# EAGLE design motor_frontplane (EAGLE 7.6.0)
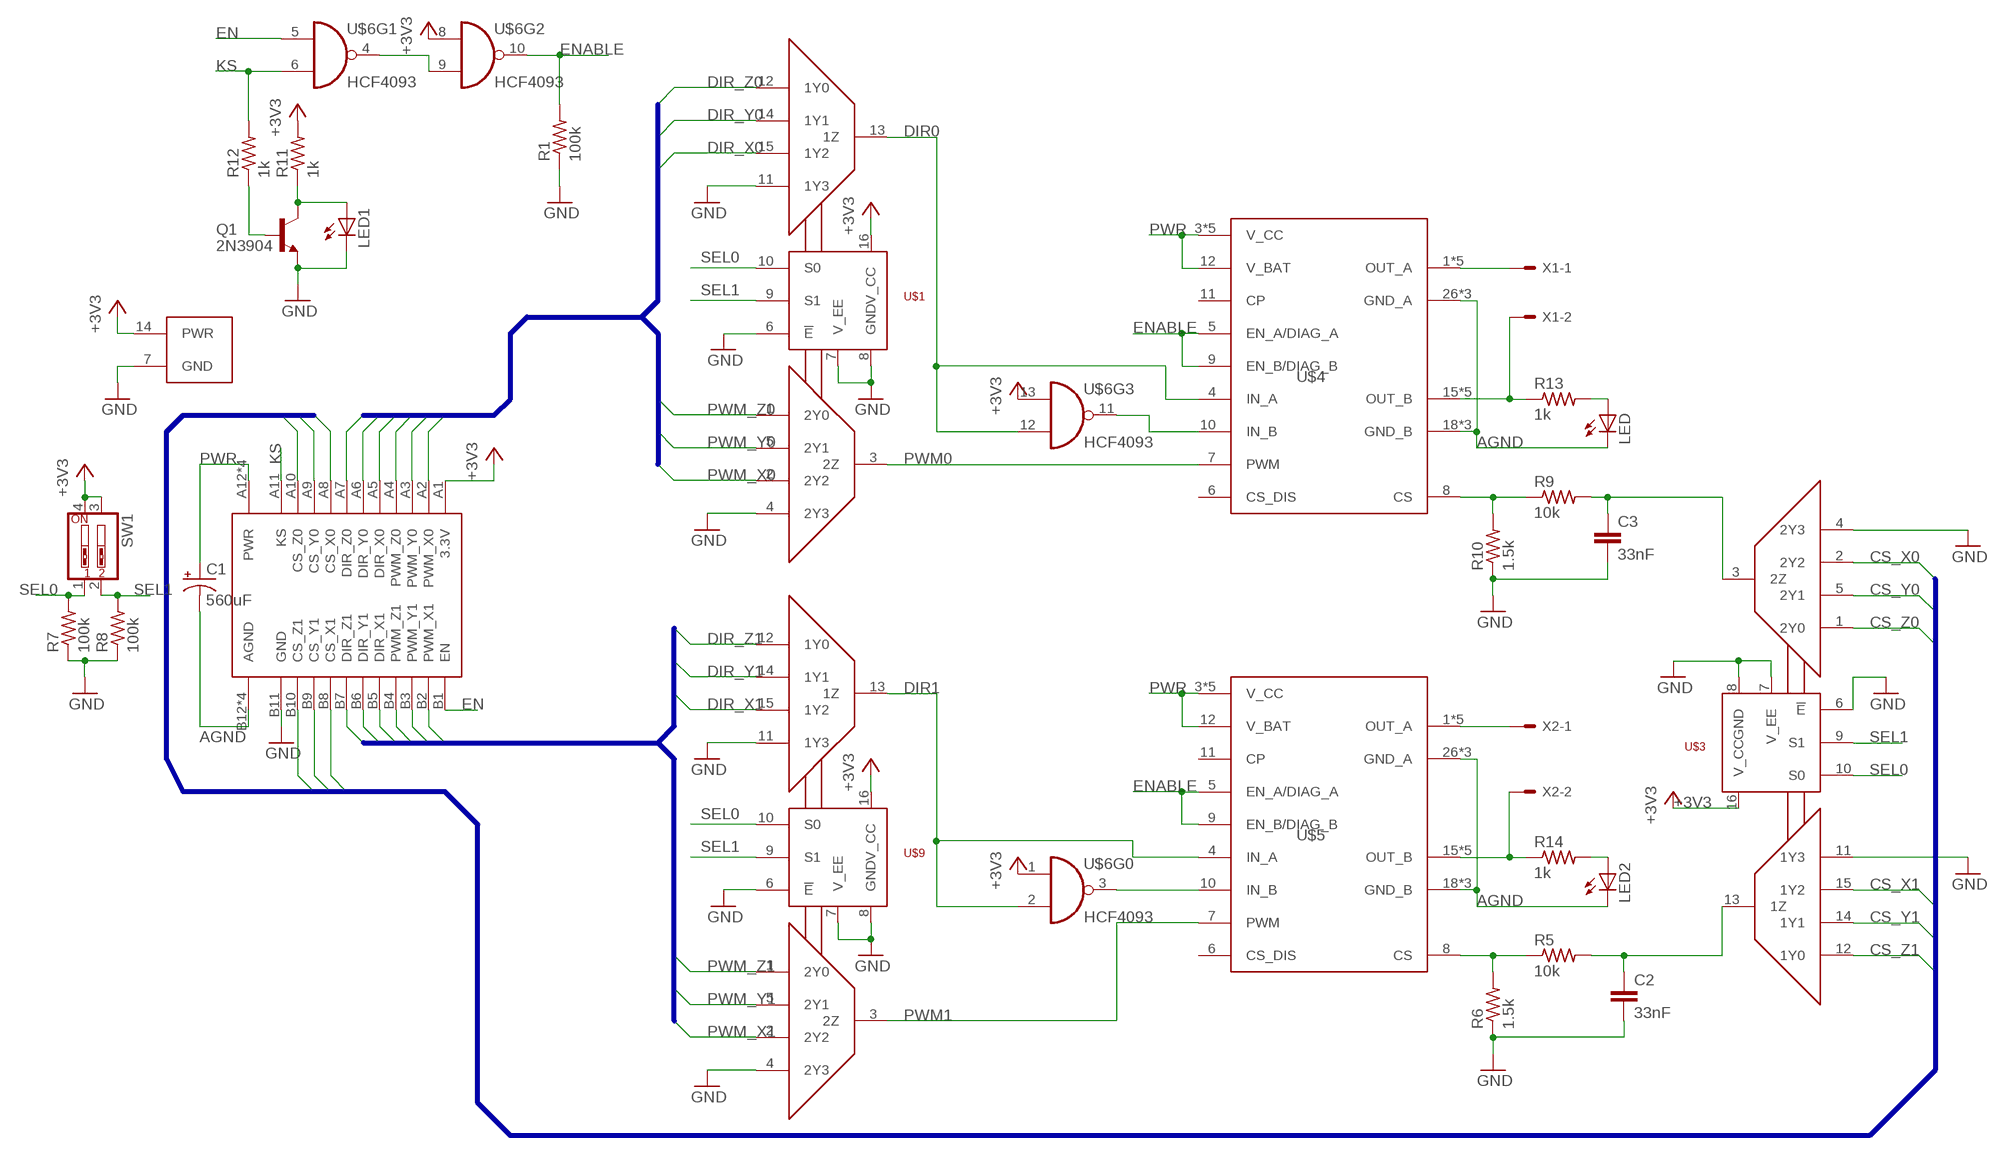
[diagram p0: schematic, sheet 1]

## Parts
C1  560uF  CPOL-USE3.5-10  [E3,5-10]
C2  33nF  C2.5/2  [C2.5-2]
C3  33nF  C2.5/2  [C2.5-2]
LED  LED5MM  [LED5MM]
LED1  LED5MM  [LED5MM]
LED2  LED5MM  [LED5MM]
Q1  2N3904  [TO92]
R1  100k  R-US_R0805  [R0805]
R5  10k  R-US_R0805  [R0805]
R6  1.5k  R-US_R0805  [R0805]
R7  100k  R-US_R0805  [R0805]
R8  100k  R-US_R0805  [R0805]
R9  10k  R-US_R0805  [R0805]
R10  1.5k  R-US_R0805  [R0805]
R11  1k  R-US_R0805  [R0805]
R12  1k  R-US_R0805  [R0805]
R13  1k  R-US_R0805  [R0805]
R14  1k  R-US_R0805  [R0805]
SW1  SW_DIP-2  [EDG-02]
U$1  74HC4052-Q100  [SO16]
U$2  MOTOR_BOARD_CONN  [CARD_30PIN_8PWR]
U$3  74HC4052-Q100  [SO16]
U$4  VNH5019A-E  [MULTIPOWERSO-30]
U$5  VNH5019A-E  [MULTIPOWERSO-30]
U$6  HCF4093  [SO14]
U$9  74HC4052-Q100  [SO16]
X1  KK-156-2  [KK-156-2]
X2  KK-156-2  [KK-156-2]

## Nets
!DIR0: U$4.10(IN_B) U$6.11(O)
!DIR1: U$5.10(IN_B) U$6.3(O)
+3V3: R11.2 SW1.3 SW1.4 U$1.16(V_CC) U$2.A1(3.3V) U$3.16(V_CC) U$6.1(I0) U$6.8(I0) U$6.13(I0) U$6.14(PWR) U$9.16(V_CC)
AGND: C1.- LED2.K(C) LED.K(C) U$2.B12(AGND) U$2.B13(AGND) U$2.B14(AGND) U$2.B15(AGND) U$4.18(GND_B) U$4.19(GND_B) U$4.20(GND_B) U$4.26(GND_A) U$4.27(GND_A) U$4.28(GND_A) U$5.18(GND_B) U$5.19(GND_B) U$5.20(GND_B) U$5.26(GND_A) U$5.27(GND_A) U$5.28(GND_A)
CS0: R9.1 R10.2 U$4.8(CS)
CS1: R5.1 R6.2 U$5.8(CS)
CS_X0: U$2.A8(CS_X0) U$3.2(2Y2)
CS_X1: U$2.B8(CS_X1) U$3.15(1Y2)
CS_Y0: U$2.A9(CS_Y0) U$3.5(2Y1)
CS_Y1: U$2.B9(CS_Y1) U$3.14(1Y1)
CS_Z0: U$2.A10(CS_Z0) U$3.1(2Y0)
CS_Z1: U$2.B10(CS_Z1) U$3.12(1Y0)
DIR0: U$1.13(1Z) U$4.4(IN_A) U$6.12(I1)
DIR1: U$5.4(IN_A) U$6.2(I1) U$9.13(1Z)
DIR_X0: U$1.15(1Y2) U$2.A5(DIR_X0)
DIR_X1: U$2.B5(DIR_X1) U$9.15(1Y2)
DIR_Y0: U$1.14(1Y1) U$2.A6(DIR_Y0)
DIR_Y1: U$2.B6(DIR_Y1) U$9.14(1Y1)
DIR_Z0: U$1.12(1Y0) U$2.A7(DIR_Z0)
DIR_Z1: U$2.B7(DIR_Z1) U$9.12(1Y0)
EN: U$2.B1(EN) U$6.5(I0)
ENABLE: R1.2 U$4.5(EN_A/DIAG_A) U$4.9(EN_B/DIAG_B) U$5.5(EN_A/DIAG_A) U$5.9(EN_B/DIAG_B) U$6.10(O)
GND: C2.2 C3.2 LED1.K(C) Q1.3(E) R1.1 R6.1 R7.1 R8.1 R10.1 U$1.4(2Y3) U$1.6(!E) U$1.7(V_EE) U$1.8(GND) U$1.11(1Y3) U$2.B11(GND) U$3.4(2Y3) U$3.6(!E) U$3.7(V_EE) U$3.8(GND) U$3.11(1Y3) U$6.7(GND) U$9.4(2Y3) U$9.6(!E) U$9.7(V_EE) U$9.8(GND) U$9.11(1Y3)
KS: R12.2 U$2.A11(KS) U$6.6(I1)
N$5: U$6.4(O) U$6.9(I1)
N$7: C2.1 R5.2 U$3.13(1Z)
N$16: LED2.A R14.2
N$23: C3.1 R9.2 U$3.3(2Z)
N$25: LED1.A Q1.1(C) R11.1
N$26: Q1.2(B) R12.1
N$28: LED.A R13.2
OUT_A0: U$4.1(OUT_A) U$4.25(OUT_A) U$4.30(OUT_A) U$4.OUTA(OUT_A) U$4.OUTA@1(OUT_A) X1.1
OUT_A1: U$5.1(OUT_A) U$5.25(OUT_A) U$5.30(OUT_A) U$5.OUTA(OUT_A) U$5.OUTA@1(OUT_A) X2.1
OUT_B0: R13.1 U$4.15(OUT_B) U$4.16(OUT_B) U$4.21(OUT_B) U$4.OUTB(OUT_B) U$4.OUTB@1(OUT_B) X1.2
OUT_B1: R14.1 U$5.15(OUT_B) U$5.16(OUT_B) U$5.21(OUT_B) U$5.OUTB(OUT_B) U$5.OUTB@1(OUT_B) X2.2
PWM0: U$1.3(2Z) U$4.7(PWM)
PWM1: U$5.7(PWM) U$9.3(2Z)
PWM_X0: U$1.2(2Y2) U$2.A2(PWM_X0)
PWM_X1: U$2.B2(PWM_X1) U$9.2(2Y2)
PWM_Y0: U$1.5(2Y1) U$2.A3(PWM_Y0)
PWM_Y1: U$2.B3(PWM_Y1) U$9.5(2Y1)
PWM_Z0: U$1.1(2Y0) U$2.A4(PWM_Z0)
PWM_Z1: U$2.B4(PWM_Z1) U$9.1(2Y0)
PWR: C1.+ U$2.A12(PWR) U$2.A13(PWR) U$2.A14(PWR) U$2.A15(PWR) U$4.3(V_CC) U$4.12(V_BAT) U$4.13(V_CC) U$4.23(V_CC) U$4.VCC(V_CC) U$4.VCC@1(V_CC) U$5.3(V_CC) U$5.12(V_BAT) U$5.13(V_CC) U$5.23(V_CC) U$5.VCC(V_CC) U$5.VCC@1(V_CC)
SEL0: R7.2 SW1.1 U$1.10(S0) U$3.10(S0) U$9.10(S0)
SEL1: R8.2 SW1.2 U$1.9(S1) U$3.9(S1) U$9.9(S1)
Unconnected: U$4.6(CS_DIS) U$4.11(CP) U$5.6(CS_DIS) U$5.11(CP)

## Buses
DIR_X1,DIR_Y1,DIR_Z1,PWM_X1,PWM_Y1,PWM_Z1
DIR_X0,DIR_Y0,DIR_Z0,PWM_X0,PWM_Y0,PWM_Z0
CS_X0,CS_X1,CS_Y0,CS_Y1,CS_Z0,CS_Z1

## Library data of the parts
C1 = rcl:CPOL-US: POLARIZED CAPACITOR, American symbol
C2 C3 = capacitor-wima:C: CAPACITOR naming: grid - package width
LED LED1 LED2 = led:LED: LED OSRAM: - CHIPLED LG R971, LG N971, LY N971, LG Q971, LY Q971, LO R971, LY R971 LH N974, LH R974 LS Q976, LO Q976, LY Q976 LO Q996 - Hyper CHIPLED LW Q18S LB Q993, LB Q99A, LB R99A - SideLED LS A670, LO A670, LY A670, LG A670, LP A670 LB A673, LV A673, LT A673, LW A673 LH A674 LY A675 LS A676, LA A676, LO A676, LY A676, LW A676 LS A679, LY A679, LG A679 - Hyper Micro SIDELED® LS Y876, LA Y876, LO Y876, LY Y876 LT Y87S - SmartLED LW L88C, LW L88S LB L89C, LB L89S, LG L890 LS L89K, LO L89K, LY L89K LS L896, LA L896, LO L896, LY L896 - TOPLED LS T670, LO T670, LY T670, LG T670, LP T670 LSG T670, LSP T670, LSY T670, LOP T670, LYG T670 LG T671, LOG T671, LSG T671 LB T673, LV T673, LT T673, LW T673 LH T674 LS T676, LA T676, LO T676, LY T676, LB T676, LH T676, LSB T676, LW T676 LB T67C, LV T67C, LT T67C, LS T67K, LO T67K, LY T67K, LW E67C LS E67B, LA E67B, LO E67B, LY E67B, LB E67C, LV E67C, LT E67C LW T67C LS T679, LY T679, LG T679 LS T770, LO T770, LY T770, LG T770, LP T770 LB T773, LV T773, LT T773, LW T773 LH T774 LS E675, LA E675, LY E675, LS T675 LS T776, LA T776, LO T776, LY T776, LB T776 LHGB T686 LT T68C, LB T68C - Hyper Mini TOPLED® LB M676 - Mini TOPLED Santana® LG M470 LS M47K, LO M47K, LY M47K Source: http://www.osram.convergy.de LUXEON: - LUMILED® LXK2-PW12-R00, LXK2-PW12-S00, LXK2-PW14-U00, LXK2-PW14-V00 LXK2-PM12-R00, LXK2-PM12-S00, LXK2-PM14-U00 LXK2-PE12-Q00, LXK2-PE12-R00, LXK2-PE12-S00, LXK2-PE14-T00, LXK2-PE14-U00 LXK2-PB12-K00, LXK2-PB12-L00, LXK2-PB12-M00, LXK2-PB14-N00, LXK2-PB14-P00, LXK2-PB14-Q00 LXK2-PR12-L00, LXK2-PR12-M00, LXK2-PR14-Q00, LXK2-PR14-R00 LXK2-PD12-Q00, LXK2-PD12-R00, LXK2-PD12-S00 LXK2-PH12-R00, LXK2-PH12-S00 LXK2-PL12-P00, LXK2-PL12-Q00, LXK2-PL12-R00 Source: www.luxeon.com KINGBRIGHT: KA-3528ASYC Source: www.kingbright.com
Q1 = transistor:2N3904: NPN TRANSISTOR
R1 R5-R14 = rcl:R-US_: RESISTOR, American symbol
SW1 = special:SW_DIP-2: DIP SWITCH
U$1 U$3 U$9 = ARVP:74HC4052-Q100: Dual 4X1 MUX / DEMUX
U$2 = ARVP:MOTOR_BOARD_CONN
U$4 U$5 = ARVP:VNH5019A-E
U$6 = ARVP:HCF4093: Quad 2 Input NAND IC
X1 X2 = con-molex:KK-156-2: KK 156 HEADER Source: http://www.molex.com/pdm_docs/sd/026604100_sd.pdf; OC_FARNELL: unknown; OC_NEWARK: unknown

## Board
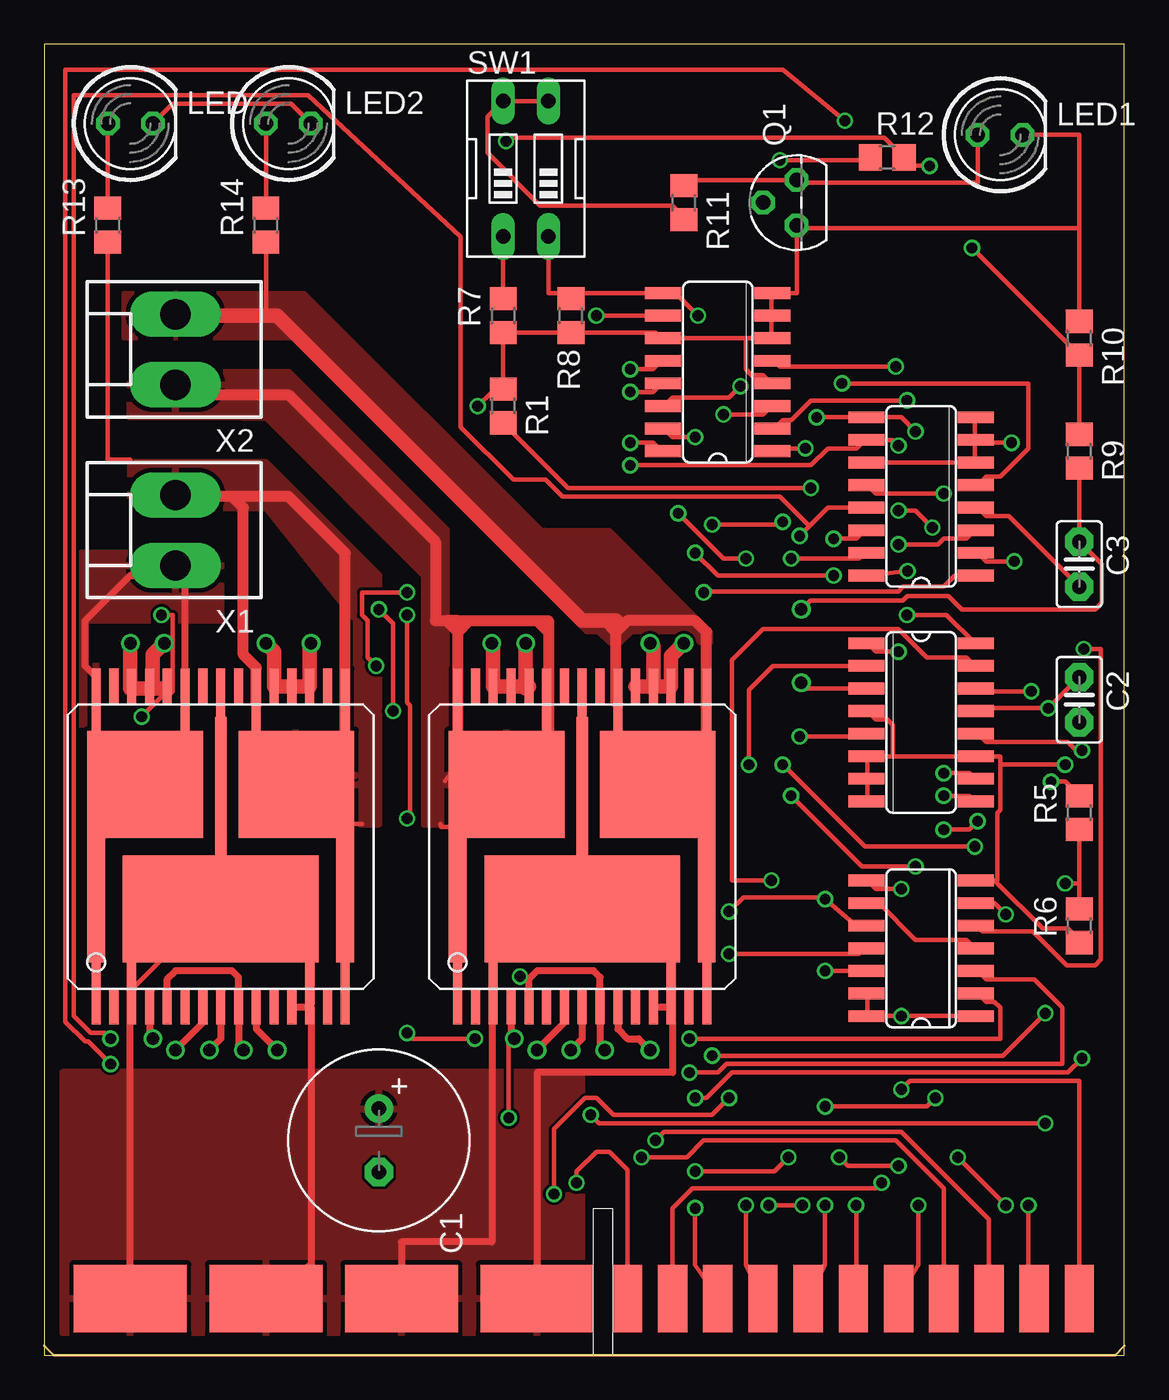
[diagram p1: board, top side]
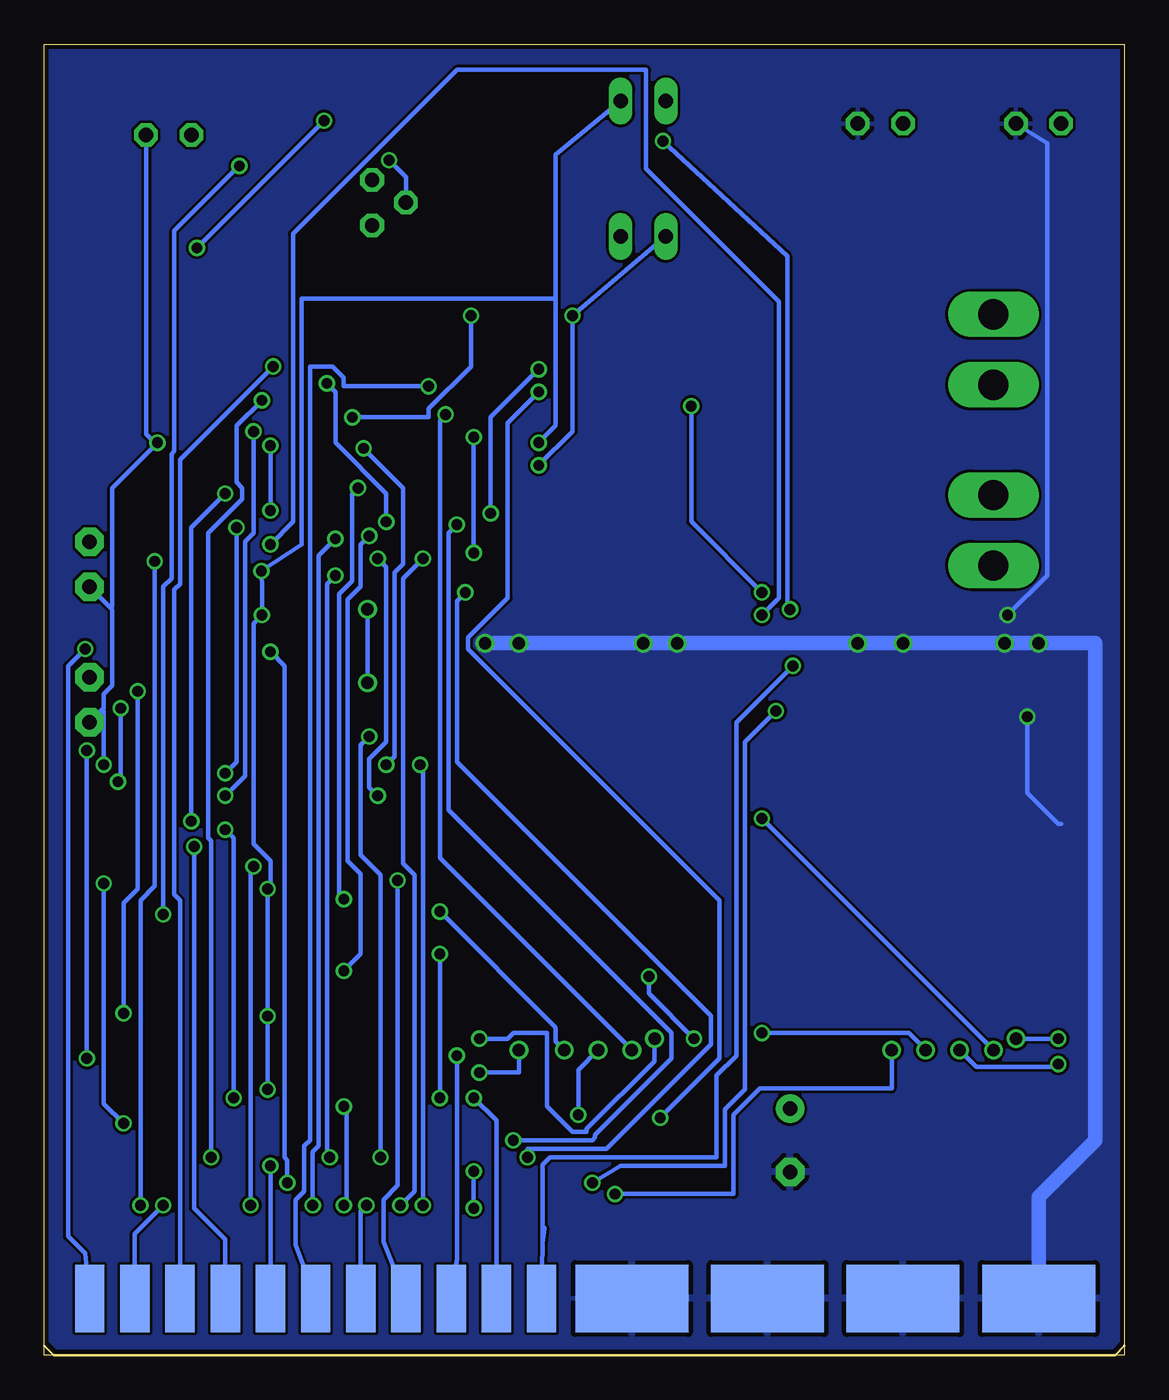
[diagram p2: board, bottom side, seen from below]

Size 60.71 x 73.66 mm. Coordinates in mm from the lower left corner, seen from the top.
Outline: 0,0 60.71,0 60.71,73.66 0,73.66 0,0
Copper layers (1*16): Top 0.035mm / dielectric 1.5mm / Bottom 0.035mm
Design rules "ITEADstudioDRC": minimum track width 6mil, minimum drill 12mil, track to track 6mil, track to pad 6mil, pad to pad 6mil, via to via 6mil, smd to smd 0mil, copper to edge 10mil, drill to drill 10mil, minimum pad ring 10mil, minimum via ring 6mil, stop-mask expansion 2mil, vias tented up to drill 100mil, thermal gap 10mil

### Footprints (pad centres in the part's own frame; a part is rotated, then mirrored left to right if it is on the bottom)
E3,5-10 = drill 0.813 pad 1.6: + -1.778,0 | drill 0.813 pad 1.6 octagon: - 1.778,0
C2.5-2 = drill 0.813 pad 1.6 octagon: 1 -1.27,0; 2 1.27,0
LED5MM = drill 0.813 octagon: A -1.27,0; K 1.27,0
TO92 = drill 0.813 octagon: 1 1.27,0; 2 0,1.905; 3 -1.27,0
R0805 = smd 1.3 x 1.5: 1 -0.95,0; 2 0.95,0
EDG-02 = drill 0.813 long: 1 -1.27,-3.81; 2 1.27,-3.81; 3 1.27,3.81; 4 -1.27,3.81
SO16 = smd 0.66 x 2.032: 1 -4.445,-3.073; 2 -3.175,-3.073; 3 -1.905,-3.073; 4 -0.635,-3.073; 5 0.635,-3.073; 6 1.905,-3.073; 7 3.175,-3.073; 8 4.445,-3.073; 9 4.445,3.073; 10 3.175,3.073; 11 1.905,3.073; 12 0.635,3.073; 13 -0.635,3.073; 14 -1.905,3.073; 15 -3.175,3.073; 16 -4.445,3.073
CARD_30PIN_8PWR = smd 1.651 x 3.81: A1 10.16,0.635; A2 7.62,0.635; A3 5.08,0.635; A4 2.54,0.635; A5 0,0.635; A6 -2.54,0.635; A7 -5.08,0.635; A8 -7.62,0.635; A9 -10.16,0.635; A10 -12.7,0.635; A11 -15.24,0.635 | smd 6.35 x 3.81: A12 -20.32,0.635; A13 -27.94,0.635; A14 -35.56,0.635; A15 -43.18,0.635 | smd 1.651 x 3.81 bottom: B1 10.16,0.635; B2 7.62,0.635; B3 5.08,0.635; B4 2.54,0.635; B5 0,0.635; B6 -2.54,0.635; B7 -5.08,0.635; B8 -7.62,0.635; B9 -10.16,0.635; B10 -12.7,0.635; B11 -15.24,0.635 | smd 6.35 x 3.81 bottom: B12 -20.32,0.635; B13 -27.94,0.635; B14 -35.56,0.635; B15 -43.18,0.635
MULTIPOWERSO-30 = smd 0.508 x 12: 1 -7,-4; 15 7,-4; 16 7,4; 30 -7,4 | smd 0.508 x 2: 2 -6,-9; 4 -4,-9; 5 -3,-9; 6 -2,-9; 7 -1,-9; 8 0,-9; 9 1,-9; 10 2,-9; 11 3,-9; 12 4,-9; 14 6,-9; 17 6,9; 18 5,9; 19 4,9; 20 3,9; 22 1,9; 24 -1,9; 26 -3,9; 27 -4,9; 28 -5,9; 29 -6,9 | smd 0.508 x 4: 3 -5,-8; 13 5,-8; 21 2,8; 23 0,8; 25 -2,8 | smd 6.5 x 6: OUTA -4.25,3.5; OUTB 4.25,3.5 | smd 1 x 7.5: OUTA@1 -7,-2.755; OUTB@1 7,-2.755 | smd 11 x 6: VCC 0,-3.5 | smd 0.65 x 8.3: VCC@1 0,3.145
SO14 = smd 0.66 x 2.032: 1 -3.81,-3.073; 2 -2.54,-3.073; 3 -1.27,-3.073; 4 0,-3.073; 5 1.27,-3.073; 6 2.54,-3.073; 7 3.81,-3.073; 8 3.81,3.073; 9 2.54,3.073; 10 1.27,3.073; 11 0,3.073; 12 -1.27,3.073; 13 -2.54,3.073; 14 -3.81,3.073
KK-156-2 = drill 1.7 pad 2.184 long: 1 -1.98,0; 2 1.98,0

### Placement (x,y rotation side)
C1  18.8,12.06 270 top
C2  58.17,36.83 270 top
C3  58.17,44.45 270 top
LED  4.83,69.22 0 top
LED1  53.72,68.58 0 top
LED2  13.72,69.22 0 top
Q1  42.29,64.77 90 top
R1  25.78,53.34 270 top
R5  58.17,30.48 90 top
R6  58.17,24.13 90 top
R7  25.78,58.42 90 top
R8  29.59,58.42 90 top
R9  58.17,50.8 270 top
R10  58.17,57.15 270 top
R11  35.94,64.77 270 top
R12  47.37,67.31 0 top
R13  3.56,63.5 90 top
R14  12.45,63.5 90 top
SW1  27.05,66.67 0 top
U$1  49.28,48.26 90 top
U$2  48.01,2.54 0 top
U$3  49.28,35.56 270 top
U$4  9.91,28.57 0 top
U$5  30.23,28.57 0 top
U$6  49.28,22.86 90 top
U$9  37.85,55.24 90 top
X1  7.37,46.35 90 top
X2  7.37,56.52 90 top

### Tracks (layer width: path | path; a pad name or v marks a point on that pad's centre or on a via)
!DIR0  (via drill 0.61, 0.7)
  Top 0.254: v38.48,22.54 45.78,22.54 46.1,22.86 U$6.11 | v38.48,14.45 37.53,13.49 31.97,13.49 31.02,14.45 30.39,14.45 28.64,12.7 v28.64,9.05
  Top 0.406: U$4.10 11.91,18.32 v13.08,17.14
  Bottom 0.254: v38.48,14.45 v38.48,22.54 | v28.64,9.05 21.97,9.05 21.97,13.49 20.48,14.99 13.08,14.99 v13.08,17.14
!DIR1  (via drill 0.61, 0.7)
  Top 0.254: v36.26,15.88 37.85,15.88 38.32,16.35 57.21,16.35 57.21,19.53 55.63,21.11 52.93,21.11 52.45,21.59 U$6.3
  Top 0.406: U$5.10 32.23,18.32 32.77,17.78 33.4,17.78 v34.04,17.14
  Bottom 0.254: v36.26,15.88 34.04,15.88 v34.04,17.14
+3V3  (via drill 0.61)
  Top 0.254: R11.2 35.94,63.98 35.31,64.61 27.84,64.61 24.89,67.56 24.89,69.6 SW1.4 SW1.3 | v32.92,51.28 34.2,51.28 34.67,50.8 U$9.16 | 46.26,19.05 46.26,20.32 U$6.13 | 46.26,19.05 v48.16,19.05 U$6.1 | 46.26,19.05 U$6.14 | v48.16,26.19 46.74,26.19 46.26,26.67 U$6.8 | v48.48,41.59 50.7,41.59 52.29,40.01 U$3.16 | v48.51,44.07 U$1.16 | U$2.A1 58.17,15.4 48.64,15.4 v48.16,14.92
  Bottom 0.254: v32.92,51.28 31.97,52.23 31.97,59.37 | 31.97,59.37 31.97,67.47 SW1.3 | v48.16,14.92 v48.16,19.05 v48.16,26.19 48.01,26.35 48.01,27.78 48.96,28.73 48.96,41.12 v48.48,41.59 48.48,43.34 v48.51,44.07 46.26,45.56 46.26,59.37 31.97,59.37
AGND  (via drill 0.61, 0.7)
  Top 0.254: U$4.28 U$4.27 U$4.26 | U$4.19 13.88,37.62 13.88,37.58 | v5.46,35.88 6.57,36.99 6.89,36.99 7.21,37.31 7.21,41.59 v6.57,41.59 | U$5.27 26.26,37.62 26.26,37.58 | LED2.K 13.88,70.33 7.21,70.33 LED.K
  Top 0.406: U$4.26 6.21,37.58 6.1,37.47 | U$4.27 4.94,37.58 4.83,37.47
  Top 0.813: v4.83,40.01 4.83,37.47 6.73,37.47 | 6.1,37.47 6.1,39.37 v6.73,40.01 | v12.45,40.01 12.91,39.55 U$4.20 13.88,37.58 U$4.19 U$4.18 14.91,39.92 v14.99,40.01 | v25.15,40.01 25.23,39.92 U$5.28 U$5.27 26.26,37.58 U$5.26 27.16,37.58 27.05,37.47 v27.05,40.01 | U$5.19 34.23,39.81 v34.04,40.01 | v35.94,40.01 35.23,39.29 U$5.18 U$5.20
  Bottom 0.254: v5.46,35.88 5.46,31.59 3.71,29.84 3.56,29.84 | v6.57,41.59 4.35,43.81 4.35,68.1 LED.K
  Bottom 0.813: v35.94,40.01 v25.15,40.01 v6.73,40.01 | v6.73,40.01 v4.83,40.01 | v6.73,40.01 1.65,40.01 1.65,12.06 4.83,8.89 U$2.B15
  pour Bottom: 1.02,1.27 30.23,1.27 30.23,13.34 2.92,13.34 3.56,29.84 1.02,34.92
  pour Bottom: 3.56,28.57 3.56,36.83 37.21,36.83 37.21,41.27 1.02,41.27 1.02,28.57
  pour Bottom: 72.9,-8.38 72.9,75.69 72.64,75.95 -6.6,75.95 -6.6,-7.62 -6.6,-8.13 -6.35,-8.38
CS0  (via drill 0.61, 0.7)
  Top 0.254: R9.1 R10.2 58.17,56.36 58.01,56.36 v52.13,62.23 | v3.71,16.35 2.44,17.62 2.29,17.62 1.18,18.73 1.18,72.23 41.5,72.23 v44.99,69.37
  Top 0.406: U$4.8 9.91,17.78 v9.27,17.14
  Bottom 0.254: v9.27,17.14 8.32,16.19 3.71,16.19 v3.71,16.35 | v52.13,62.23 v44.99,69.37
CS1  (via drill 0.61, 0.7)
  Top 0.254: R5.1 58.17,26.51 | 58.17,26.51 R6.2 | v30.7,13.49 31.18,13.02 v56.26,13.02 | 58.17,26.51 v57.37,26.51
  Top 0.406: U$5.8 30.23,17.78 v29.59,17.14
  Bottom 0.254: v29.59,17.14 30.7,16.03 v30.7,13.49 | v56.26,13.02 57.37,14.13 v57.37,26.51
CS_X0  (via drill 0.61)
  Top 0.254: v39.43,8.41 39.43,5.08 U$2.A8 | v39.59,33.18 39.59,37.37 40.96,38.73 U$3.2 46.99,38.73
  Bottom 0.254: v39.59,33.18 39.43,33.02 v39.43,8.41
CS_X1  (via drill 0.61)
  Top 0.254: v40.86,26.67 38.64,26.67 38.64,39.05 40.39,40.8 48.01,40.8 49.59,39.21 51.82,39.21 52.29,38.73 U$3.15
  Bottom 0.254: v40.86,26.67 40.86,9.53 41.66,8.73 41.66,6.35 U$2.B8
CS_Y0  (via drill 0.61)
  Top 0.254: v42.45,34.77 45.94,34.77 46.1,34.92 U$3.5 | v41.81,11.11 41.02,10.32 v36.58,10.32 | v36.58,8.26 36.58,5.08 U$2.A9
  Bottom 0.254: v42.45,34.77 42.93,34.29 42.93,28.1 41.81,26.99 v41.81,11.11 | v36.58,8.26 v36.58,10.32
CS_Y1  (via drill 0.61)
  Top 0.254: v55.47,37.31 52.61,37.31 52.45,37.47 U$3.14 | v56.26,19.21 53.88,16.83 v37.53,16.83
  Bottom 0.254: v55.47,37.31 55.47,26.19 56.26,25.4 v56.26,19.21 | v37.53,16.83 37.53,5.4 U$2.B9
CS_Z0  (via drill 0.61)
  Top 0.254: v48.01,39.53 46.74,39.53 46.26,40.01 U$3.1 | v47.05,9.68 46.74,9.37 36.42,9.37 35.31,8.26 U$2.A10
  Bottom 0.254: v48.01,39.53 47.21,38.73 47.21,11.11 47.05,10.95 v47.05,9.68
CS_Z1  (via drill 0.61)
  Top 0.254: v58.33,33.97 58.01,33.97 57.53,34.45 52.93,34.45 52.45,34.92 U$3.12 | v58.33,16.67 57.53,15.88 38.64,15.88 37.21,14.45 v36.58,14.45
  Bottom 0.254: v58.33,16.67 v58.33,33.97 | v36.58,14.45 35.31,13.18 U$2.B10
DIR0  (via drill 0.61, 0.7)
  Top 0.254: v43.88,21.59 U$6.12 | 43.01,46.59 44.04,47.62 U$1.13 | 43.01,46.59 v42.45,46.04 | v3.71,17.78 3.4,18.1 2.6,18.1 1.65,19.05 1.65,70.8 14.83,70.8 23.4,62.87 23.4,52.16 26.35,49.21 28.16,49.21 29.11,48.26 41.34,48.26 43.01,46.59
  Top 0.406: U$4.4 5.91,17.97 v6.1,17.78
  Bottom 0.254: v43.88,21.59 42.93,22.54 42.93,27.05 43.66,27.78 43.66,42.45 42.93,43.18 42.93,45.56 v42.45,46.04 | v3.71,17.78 v6.1,17.78
DIR1  (via drill 0.61, 0.7)
  Top 0.254: v36.26,17.78 53.72,17.78 53.72,19.53 53.4,19.84 52.93,19.84 52.45,20.32 U$6.2 | v32.92,54.13 34.2,54.13 34.67,54.61 U$9.13 | v26.1,13.34 26.1,17.94 v26.42,17.78
  Top 0.406: U$5.4 26.23,17.97 v26.42,17.78
  Bottom 0.254: v36.26,17.78 34.67,17.78 34.35,18.1 32.45,18.1 32.45,13.97 31.02,12.54 30.23,12.54 30.23,12.7 26.42,16.51 v26.42,17.78 | v32.92,54.13 34.67,52.39 34.67,42.55 36.89,40.32 36.89,39.69 22.77,25.56 22.77,16.67 v26.1,13.34
DIR_X0  (via drill 0.61)
  Top 0.254: v41.97,44.77 45.78,44.77 46.1,45.09 U$1.15 | v41.97,31.43 45.94,27.46 v48.96,27.46 | v49.12,8.41 49.12,5.08 U$2.A5
  Bottom 0.254: v41.97,44.77 41.5,44.29 41.5,34.45 42.45,33.5 42.45,31.91 v41.97,31.43 | v48.96,27.46 49.12,27.3 v49.12,8.41
DIR_X1  (via drill 0.61)
  Top 0.254: v36.58,51.59 35.31,51.59 34.83,52.07 U$9.15 | v36.58,45.09 37.85,43.81 v44.35,43.81 | v44.67,11.11 45.15,10.64 v48.01,10.64
  Bottom 0.254: v36.58,45.09 v36.58,51.59 | v44.35,43.81 44.83,43.34 44.83,11.27 v44.67,11.11 | U$2.B5 v48.01,10.64
DIR_Y0  (via drill 0.61)
  Top 0.254: v44.35,45.88 45.62,45.88 46.1,46.35 U$1.14 | v45.62,8.41 45.62,5.08 U$2.A6
  Bottom 0.254: v44.35,45.88 45.31,44.93 45.31,11.75 45.62,11.43 v45.62,8.41
DIR_Y1  (via drill 0.61)
  Top 0.254: v39.12,54.45 38.48,53.82 35.31,53.82 34.83,53.34 U$9.14
  Bottom 0.254: v39.12,54.45 43.88,54.45 43.88,54.93 44.51,55.56 45.78,55.56 45.78,12.06 46.1,11.75 46.1,9.21 46.58,8.73 46.58,6.19 U$2.B6
DIR_Z0  (via drill 0.61)
  Top 0.254: v50.55,48.42 46.74,48.42 46.26,48.9 U$1.12 | v52.45,30 51.98,29.53 v50.55,29.53 | v50.07,14.45 49.59,13.97 v43.88,13.97 | v43.88,8.41 43.88,5.08 U$2.A7
  Bottom 0.254: v50.55,48.42 52.45,46.51 v52.45,30 | v50.55,29.53 50.07,29.05 v50.07,14.45 | v43.88,13.97 43.72,13.81 43.72,8.57 v43.88,8.41
DIR_Z1  (via drill 0.61)
  Top 0.254: v32.92,55.4 34.2,55.4 34.67,55.88 U$9.12 | v35.62,47.31 38.16,44.77 v39.43,44.77 | v42.61,8.41 v40.7,8.41
  Bottom 0.254: v32.92,55.4 35.62,52.7 v35.62,47.31 | v39.43,44.77 40.55,43.66 40.55,27.62 39.91,26.99 39.91,9.21 v40.7,8.41 | v42.61,8.41 42.93,8.1 U$2.B7
EN  (via drill 0.61)
  Top 0.254: v58.42,39.69 59.37,39.69 59.37,22.23 59.05,21.91 57.47,21.91 55.56,23.81 52.7,23.81 52.39,24.13 U$6.5
  Bottom 0.254: v58.42,39.69 59.37,38.73 59.37,6.67 58.42,5.71 U$2.B1
ENABLE  (via drill 0.61, 0.7)
  Top 0.254: v20.38,18.1 20.7,17.78 v24.19,17.78 | v26.73,21.27 26.89,21.11 27.05,21.11 27.23,21.13 | v43.09,48.74 29.43,48.74 R1.2 | U$6.10 45.62,24.13 v43.88,25.62 43.88,25.72 39.27,25.72 v38.48,24.92
  Top 0.406: U$4.5 6.91,21.13 7.37,21.59 10.54,21.59 10.91,21.23 U$4.9 10.91,17.41 v11.18,17.14 | v31.5,17.14 31.23,17.41 U$5.9 31.23,21.23 30.86,21.59 27.69,21.59 27.23,21.13 U$5.5
  Bottom 0.254: v11.18,17.14 12.13,18.1 v20.38,18.1 | v24.19,17.78 26.73,20.32 v26.73,21.27 | v43.09,48.74 43.4,48.42 43.4,43.5 44.13,42.77 44.13,25.88 v43.88,25.62 | v31.5,17.14 31.97,17.62 31.97,18.41 v38.48,24.92
GND  (via drill 0.61)
  Top 0.254: 53.48,26.59 53.4,26.67 U$6.7 | 53.48,26.59 56.1,23.97 57.53,23.97 58.17,23.34 R6.1 | 46.26,32.38 46.26,31.11 U$3.8 | 46.26,32.38 46.26,33.66 | 46.26,32.38 U$3.7 | 47.69,33.66 47.69,35.4 47.37,35.72 46.74,35.72 46.26,36.2 U$3.4 | 46.26,33.66 47.69,33.66 | 46.26,33.66 U$3.6 | 47.69,33.66 U$3.11 53.72,33.66 53.72,33.18 | 53.72,33.18 53.72,30.64 53.56,30.48 53.56,26.67 53.48,26.59 | 52.29,51.44 52.29,52.7 U$1.8 | 52.29,50.16 U$1.11 | 52.29,50.16 52.29,51.44 | 52.29,51.44 U$1.7 52.45,51.44 52.61,51.28 v54.36,51.28 | 52.29,50.16 U$1.6 | C3.2 54.2,47.15 52.93,47.15 52.45,47.62 U$1.4 | v57.37,33.18 53.72,33.18 | 58.17,63.34 58.17,68.58 LED1.K | 58.17,63.34 R10.1 | 40.86,58.42 40.86,59.69 U$9.8 42.29,59.69 42.29,63.34 | 39.43,57.15 39.43,55.4 39.75,55.09 40.39,55.09 40.86,54.61 U$9.4 | 40.86,57.15 39.43,57.15 | 40.86,57.15 40.86,58.42 | 40.86,58.42 U$9.7 | 40.86,57.15 U$9.6 | R7.1 R1.1 25.78,54.13 25.15,54.13 v24.35,53.34 | R7.1 R8.1 | R7.1 | R8.1 34.35,57.47 34.67,57.15 U$9.11 39.43,57.15 | R8.1 | v18.64,38.73 18.16,39.21 18.16,41.27 17.84,41.59 17.84,42.86 v20.38,42.86 | 42.29,63.34 58.17,63.34 | 42.29,63.34 Q1.3
  Bottom 0.254: 57.45,36.27 57.37,36.35 57.37,37.15 56.9,37.62 56.9,41.91 56.98,41.99 | 57.45,36.27 C2.2 | C3.2 56.98,41.99 | 56.98,41.99 56.9,42.07 56.9,48.74 v54.36,51.28 54.52,51.28 54.99,51.75 LED1.K | v57.37,33.18 57.37,36.2 57.45,36.27 | 32.61,7.14 32.7,6.31 | 32.7,6.31 U$2.B11 | v18.64,38.73 21.81,35.56 21.81,16.83 22.92,15.72 22.92,11.11 32.29,11.11 32.7,10.7 32.7,6.31 | v20.38,42.86 24.35,46.83 v24.35,53.34
KS  (via drill 0.61)
  Top 0.254: R12.2 48.8,66.83 v49.75,66.83 | v54.04,24.77 53.4,25.4 U$6.6 | v19.59,36.2 19.59,41.12 v18.8,41.91 | v25.94,68.23 26.26,68.42 47.21,68.42 R12.2 | R12.2 | U$2.A11 32.77,10.41 31.75,11.43 31.02,11.43 29.91,10.32 v29.91,9.68
  Bottom 0.254: v49.75,66.83 53.4,63.18 53.4,50.8 53.56,50.64 53.56,43.66 54.04,43.18 v54.04,24.77 | v29.91,9.68 28.32,10.64 22.45,10.64 22.45,13.81 21.34,14.92 21.34,34.45 v19.59,36.2 | v18.8,41.91 18.95,42.07 18.95,61.75 v25.94,68.23
N$5
  Top 0.254: U$6.9 46.9,25.4 48.96,23.34 51.82,23.34 52.29,22.86 U$6.4
N$7  (via drill 0.61)
  Top 0.254: v56.58,32.23 57.37,32.23 R5.2 | C2.1 v56.42,36.35 52.61,36.35 52.45,36.2 U$3.13
  Bottom 0.254: v56.58,32.23 56.42,32.38 v56.42,36.35
N$16
  Top 0.254: LED2.A R14.2
N$23  (via drill 0.7)
  Top 0.254: R9.2 C3.1 59.44,44.45 59.44,42.29 59.05,41.91 51.56,41.91 50.8,42.67 48.51,42.67 48.26,42.42 43.05,42.42 v42.55,41.91 42.86,42.23 | U$3.3 42.86,37.47 v42.55,37.78
  Bottom 0.254: v42.55,41.91 v42.55,37.78
N$25
  Top 0.254: R11.1 36.26,66.04 Q1.1 42.45,65.88 52.45,65.88 LED1.A
N$26  (via drill 0.61)
  Top 0.254: v41.34,67.15 46.26,67.15 R12.1
  Bottom 0.254: v41.34,67.15 40.39,66.2 Q1.2
N$28
  Top 0.254: LED.A R13.2
OUT_A0
  Top 0.254: U$4.OUTA 5.62,32.23 5.3,32.54 3.08,32.54 U$4.30 2.92,32.38 2.92,25.88 U$4.OUTA@1 2.92,25.72 2.92,24.61 U$4.1
  Top 0.406: U$4.25 7.91,43.84 X1.1 6.81,43.81 4.83,43.81 2.29,41.27 2.29,38.73 2.91,38.12 U$4.30
  pour Top: 3.56,36.2 1.02,31.75 1.02,45.09 9.91,45.09 9.91,41.27 2.29,41.27 2.29,38.73 3.56,38.73
OUT_A1
  Top 0.254: U$5.1 23.24,24.61 23.24,25.72 U$5.OUTA@1 23.08,25.88 23.08,29.69 22.29,29.69 22.27,29.84 | 28.32,36.67 U$5.25 | 22.52,32.28 22.61,32.38 22.77,32.54 23.08,32.54 U$5.30
  Top 0.61: X2.1 7.93,53.98 13.72,53.98 21.97,45.72 21.97,41.27 22.61,41.27 | 23.24,41.27 23.88,41.27 | 27.69,41.27 28.32,41.27 28.32,40.64 | 28.32,40.64 28.32,36.67 28.32,33.66 26.74,32.08 U$5.OUTA 23.24,34.81 23.24,40.64 | 23.24,40.64 23.24,41.27 | 23.24,41.27 22.61,41.27 | 22.61,41.27 23.24,40.64 | 23.24,40.64 23.88,41.27 | 23.88,41.27 27.69,41.27 | 27.69,41.27 28.32,40.64
  pour Top: 12.45,52.7 21.34,43.81 21.34,29.84 28.96,29.84 28.96,34.92 23.88,34.92 23.88,38.73 22.61,38.73 22.61,46.35 13.72,55.24 11.18,52.7
  pour Top: 12.45,52.7 4.83,52.7 4.83,55.24 13.72,55.24
OUT_B0
  Top 0.254: R13.1 3.56,50.32 4.83,50.32 4.83,50.16 | U$4.16 16.73,32.38 16.57,32.23 14.19,32.23 U$4.OUTB 17.14,32.38 17.14,29.84 | 17.86,29.84 17.14,29.84 | 17.14,29.84 17.05,29.84 17.05,25.88 U$4.OUTB@1 16.89,25.72 16.89,24.61 U$4.15 17.14,29.84
  Top 0.61: U$4.16 16.91,45.07 13.72,48.26 10.54,48.26 | 10.54,48.26 7.44,48.26 X1.2 | U$4.21 11.91,38.64 11.18,39.37 11.18,47.62 10.54,48.26
  pour Top: 11.18,29.84 18.8,29.84 18.8,43.81 12.45,50.16 4.83,50.16 4.83,47.62 12.45,47.62 17.53,41.27 17.53,38.73 16.26,38.73 16.26,34.92 11.18,34.92
OUT_B1
  Top 0.254: U$5.15 37.21,24.61 37.21,25.72 U$5.OUTB@1 37.21,25.88 37.21,32.23 37.05,32.23 U$5.16 37.05,32.38 36.89,32.23 34.51,32.23 U$5.OUTB | 12.45,58.42 R14.1
  Top 0.61: U$5.21 32.13,36.67 32.13,40.64 | U$5.16 37.21,32.59 37.21,40.64 36.58,41.27 32.77,41.27 32.13,40.64 | 32.13,40.64 31.5,41.27
  Top 0.813: X2.2 7.44,58.42 12.45,58.42 13.08,58.42 30.23,41.27 31.5,41.27 32.13,41.27
  pour Top: 4.45,59.69 4.45,57.15 13.97,57.15 30.48,40.64 31.11,40.64 31.75,40.01 32.38,40.01 33.02,40.64 36.2,40.64 36.83,40.01 37.47,40.01 37.47,40.64 31.75,46.35 27.94,46.35 14.61,59.69
PWM0  (via drill 0.61, 0.7)
  Top 0.254: v48.01,45.56 50.23,45.56 50.55,45.88 51.82,45.88 52.29,46.35 U$1.3 | v20.38,41.59 20.38,36.67 20.54,36.51 20.54,30.16 v20.38,30.16
  Top 0.406: U$4.7 8.91,18.68 v7.37,17.14
  Bottom 0.254: v48.01,45.56 46.74,46.83 46.74,63.02 37.53,72.23 26.89,72.23 26.89,66.67 19.43,59.21 19.43,42.55 v20.38,41.59 | v7.37,17.14 v20.38,30.16
PWM1  (via drill 0.61, 0.7)
  Top 0.254: v38.16,52.86 40.39,52.86 40.86,53.34 U$9.3
  Top 0.406: U$5.7 29.23,18.68 v27.69,17.14
  Bottom 0.254: v38.16,52.86 38.48,52.55 38.48,27.94 v27.69,17.14
PWM_X0  (via drill 0.61)
  Top 0.254: v54.52,44.61 52.93,44.61 52.45,45.09 U$1.2 | v55.31,8.41 55.31,5.08 U$2.A2
  Bottom 0.254: v54.52,44.61 54.52,26.35 55.31,25.56 v55.31,8.41
PWM_X1  (via drill 0.61)
  Top 0.254: v48.48,53.66 43.09,53.66 41.97,52.55 41.5,52.55 41.02,52.07 U$9.2 | v54.04,8.41 v51.34,11.11
  Bottom 0.254: v48.48,53.66 49.91,52.23 49.91,49.05 49.59,48.74 49.59,48.1 51.5,46.2 51.5,29.05 51.34,28.89 v51.34,11.11 | v54.04,8.41 55.63,6.83 U$2.B2
PWM_Y0  (via drill 0.61)
  Top 0.254: v44.83,54.61 55.31,54.61 55.31,50.96 53.72,49.37 52.93,49.37 52.45,48.9 U$1.5 | v41.5,46.83 41.34,46.67 v37.53,46.67 | v34.35,12.06 34.83,12.54 48.16,12.54 53.09,7.62 U$2.A3
  Bottom 0.254: v44.83,54.61 44.35,54.13 44.35,51.28 41.5,48.42 v41.5,46.83 | v37.53,46.67 38.01,46.2 38.01,30.64 25.46,18.1 25.46,16.67 29.75,12.38 29.75,12.22 29.91,12.06 v34.35,12.06
PWM_Y1  (via drill 0.61)
  Top 0.254: v47.85,55.56 41.34,55.56 41.02,55.88 U$9.5
  Bottom 0.254: v47.85,55.56 53.09,50.32 53.09,43.34 53.4,43.02 53.4,25.88 53.09,25.56 U$2.B3
PWM_Z0  (via drill 0.61)
  Top 0.254: v33.56,11.11 36.1,11.11 37.05,12.06 47.85,12.06 50.55,9.37 U$2.A4 | U$1.1 51.18,43.81 50.55,43.18 48.26,43.18 48.01,42.93 37.12,42.93 v37.05,42.86
  Bottom 0.254: v37.05,42.86 37.53,42.39 37.53,33.34 23.24,19.05 23.24,17.46 29.11,11.59 33.56,11.59 v33.56,11.11
PWM_Z1  (via drill 0.61)
  Top 0.254: v42.77,50.96 41.18,50.96 41.02,50.8 U$9.1 | v41.5,33.18 46.1,28.57 v52.29,28.57
  Bottom 0.254: v42.77,50.96 40.55,48.74 40.55,44.45 41.02,43.97 41.02,33.66 v41.5,33.18 | v52.29,28.57 52.29,8.26 50.55,6.51 U$2.B4
PWR
  Top 0.254: U$5.23 U$5.VCC@1 U$5.VCC | 4.99,20.64 4.83,20.64 | 4.99,20.64 9.27,24.92 9.91,24.92 U$4.VCC | 4.99,20.64 U$4.3 | U$5.3 25.3,20.64 25.15,20.64 | U$4.VCC@1 U$4.23
  Top 0.406: U$2.A15 4.83,20.64 4.83,23.5 | U$4.VCC@1 9.91,26.04 14.99,26.04 14.99,19.68 | 14.99,19.57 14.99,5.08 U$2.A14 | 35.31,19.57 35.31,25.07 U$5.VCC 25.15,25.07 25.15,20.64 25.15,6.35 20.07,6.35 U$2.A13 | 35.31,19.57 35.31,15.88 27.69,15.88 U$2.A12 | U$4.12 14.99,19.57 | 14.99,19.57 14.99,19.68 | 14.99,19.68 14.91,19.68 U$4.13 | U$5.12 35.23,19.57 | 35.31,19.57 35.23,19.57 | 35.23,19.57 U$5.13
  pour Top: 1.02,1.27 30.23,1.27 30.23,15.88 1.02,15.88
SEL0  (via drill 0.61)
  Top 0.254: SW1.1 R7.2 | v31.02,58.42 U$9.10 | v32.92,50.01 43.09,50.01 44.04,50.96 45.62,50.96 46.1,51.44 U$1.10 47.69,51.44 v48.01,51.12 | v50.55,32.7 51.98,32.7 52.29,32.38 U$3.10 | v49.91,46.51 48.96,47.47 v48.01,47.47
  Bottom 0.254: SW1.1 25.94,62.74 v31.02,58.42 31.02,51.91 v32.92,50.01 | v50.55,32.7 49.91,33.34 v49.91,46.51 | v48.01,51.12 v48.01,47.47
SEL1  (via drill 0.61)
  Top 0.254: v43.4,52.7 U$1.9 48.16,52.7 v48.96,51.91 | v36.73,58.42 35.47,59.69 U$9.9 29.91,59.69 R8.2 29.75,59.69 28.32,59.69 SW1.2 | v50.55,31.43 51.98,31.43 52.29,31.11 U$3.9
  Bottom 0.254: v43.4,52.7 39.12,52.7 39.12,53.18 36.73,55.56 v36.73,58.42 | v50.55,31.43 49.44,32.54 49.44,45.72 48.96,46.2 v48.96,51.91